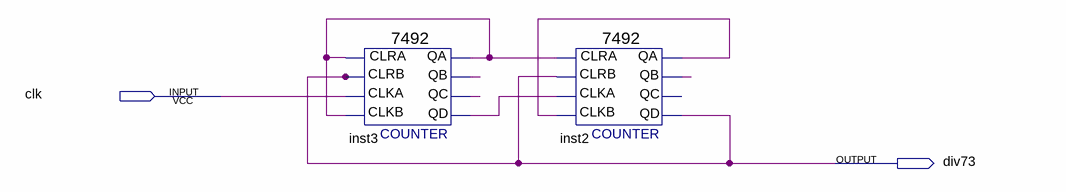
[diagram p0: schematic sheet]
// Quartus schematic div_73.bdf as structural Verilog: 2 symbols, 2 pins
module div_73 (
  input  clk,
  output div73
);

  wire inst2_qa, inst2_qb, inst3_qa, inst3_qb, inst3_qc, inst3_qd;

  \7492  inst3 (
    .CLKB(inst3_qa), .CLRA(inst3_qa), .CLKA(clk), .CLRB(div73), .QB(inst3_qb), .QC(inst3_qc), .QD(inst3_qd),
    .QA(inst3_qa));
  \7492  inst2 (
    .CLKB(inst2_qa), .CLRA(inst3_qa), .CLKA(inst3_qd), .CLRB(div73), .QB(inst2_qb), .QD(div73), .QA(inst2_qa));  // open: QC
endmodule
